# EAGLE design czujnik smrodu mkrwan v02 (EAGLE 8.6.0)
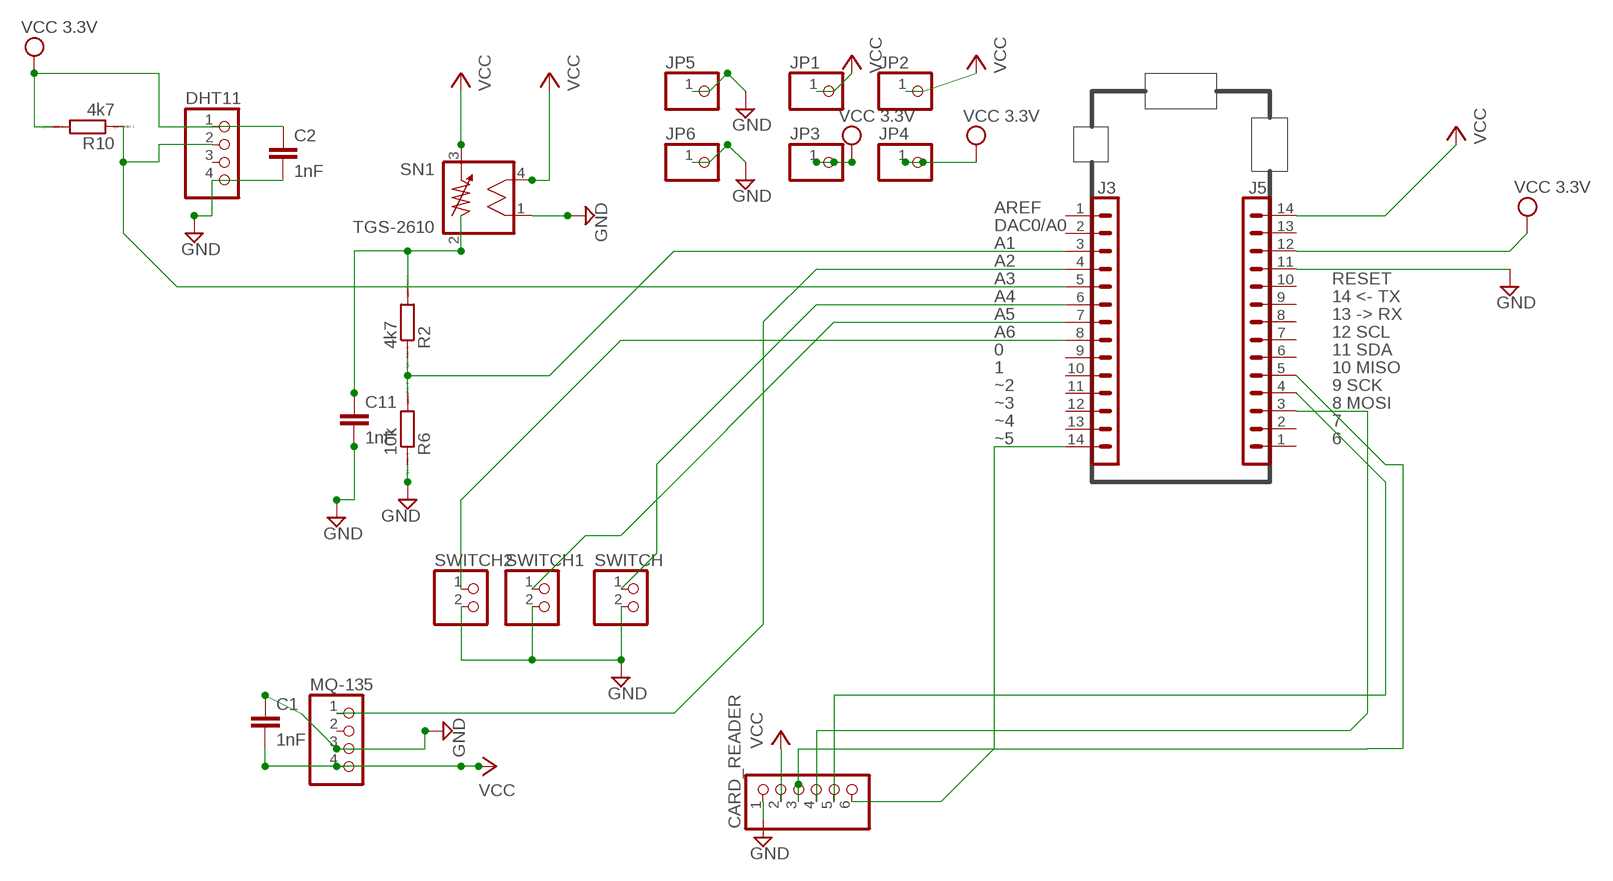
[diagram p0: schematic, sheet 1]

## Parts
C1  1nF  C2,5-3  [C2.5-3]
C2  1nF  C2,5-3  [C2.5-3]
C11  1nF  C2,5-3  [C2.5-3]
CARD_READER  PINHD-1X6  [1X06]
DHT11  PINHD-1X4  [1X04]
J3  DNP  PINHD-1X14-SMTH-SMD  [1X14_SMD_TH]
J5  DNP  PINHD-1X14-SMTH-SMD  [1X14_SMD_TH]
JP1  PINHD-1X1  [1X01]
JP2  PINHD-1X1  [1X01]
JP3  PINHD-1X1  [1X01]
JP4  PINHD-1X1  [1X01]
JP5  PINHD-1X1  [1X01]
JP6  PINHD-1X1  [1X01]
MQ-135  PINHD-1X4  [1X04]
R2  4k7  R0207/10  [0207/10]
R6  10k  R0207/10  [0207/10]
R10  4k7  R0207/10  [0207/10]
SN1  TGS-2610  [TGS-2610]
SWITCH  PINHD-1X2  [1X02]
SWITCH1  PINHD-1X2  [1X02]
SWITCH2  PINHD-1X2  [1X02]

## Nets
GND: C1.1 C2.2 C11.2 CARD_READER.1 DHT11.4 J5.11 JP5.1 JP6.1 MQ-135.3 R6.1 SN1.1 SWITCH1.2 SWITCH2.2 SWITCH.2
N$7: CARD_READER.3 J5.5
N$9: CARD_READER.4 J5.3
N$11: CARD_READER.5 J5.4
PA04_AIN4: DHT11.2 J3.5 R10.1
PA05_AIN5: J3.6 SWITCH.1
PA06_AIN6: J3.7 SWITCH1.1
PA07_AIN7: J3.8 SWITCH2.1
PB02_AIN10: J3.3 R2.1 R6.2
PB03_AIN11: J3.4 MQ-135.1
PB11_TCC0-W5: CARD_READER.6 J3.14
TGS2603_AIN: C11.1 R2.2 SN1.2
VCC: C1.2 C2.1 CARD_READER.2 DHT11.1 J5.12 J5.14 JP1.1 JP2.1 JP3.1 JP4.1 MQ-135.4 R10.2 SN1.3 SN1.4 ; supply symbol labelled VCC 3.3V
Unconnected: DHT11.3 J3.1 J3.2 J3.9 J3.10 J3.11 J3.12 J3.13 J5.1 J5.2 J5.6 J5.7 J5.8 J5.9 J5.10 J5.13 MQ-135.2

## Notes on the sheet
- AREF
- DAC0/A0
- A1
- A2
- A3 | RESET
- A4 | 14 <- TX
- A5 | 13 -> RX
- A6 | 12 SCL
- 0 | 11 SDA
- 1 | 10 MISO
- ~2 | 9 SCK
- ~3 | 8 MOSI
- ~4 | 7
- ~5 | 6

## Library data of the parts
C1 C2 C11 = capacitor-wima:C: CAPACITOR naming: grid - package width
CARD_READER = pinhead:PINHD-1X6: PIN HEADER
DHT11 MQ-135 = pinhead:PINHD-1X4: PIN HEADER
J3 J5 = Arduino-connectors:PINHD-1X14-SM: PIN HEADER; DATASHEET: -; DISTRIBUTOR-LINK: -; DISTRIBUTOR-PN: -; MANUFACTURER: ELDECO; MANUFACTURER-PN: FH254114DF08500T
JP1-JP6 = pinhead:PINHD-1X1: PIN HEADER
R2 R6 R10 = eagle-ltspice:R: RESISTOR, European symbol; SPICEMODEL: NONE; SPICEPREFIX: R
SN1 = figaro:TGS-2610: SENSOR TGS 2610 - Gas Sensor
SWITCH SWITCH1 SWITCH2 = pinhead:PINHD-1X2: PIN HEADER

## Net classes
0 default: width 0.25 mm, drill 0.195 mm

## Board
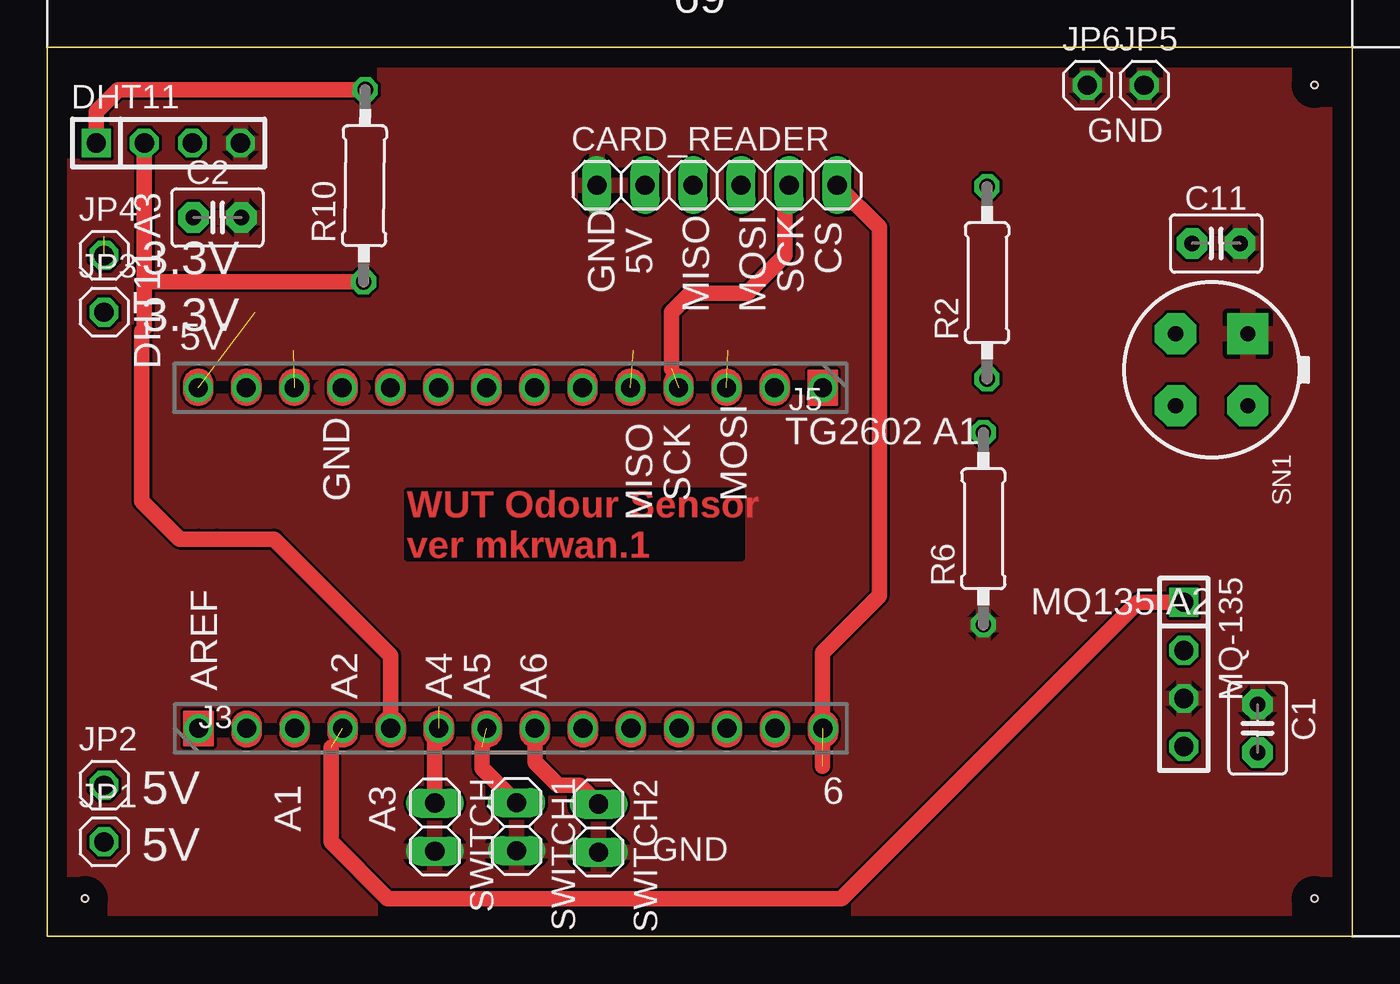
[diagram p1: board, top side]
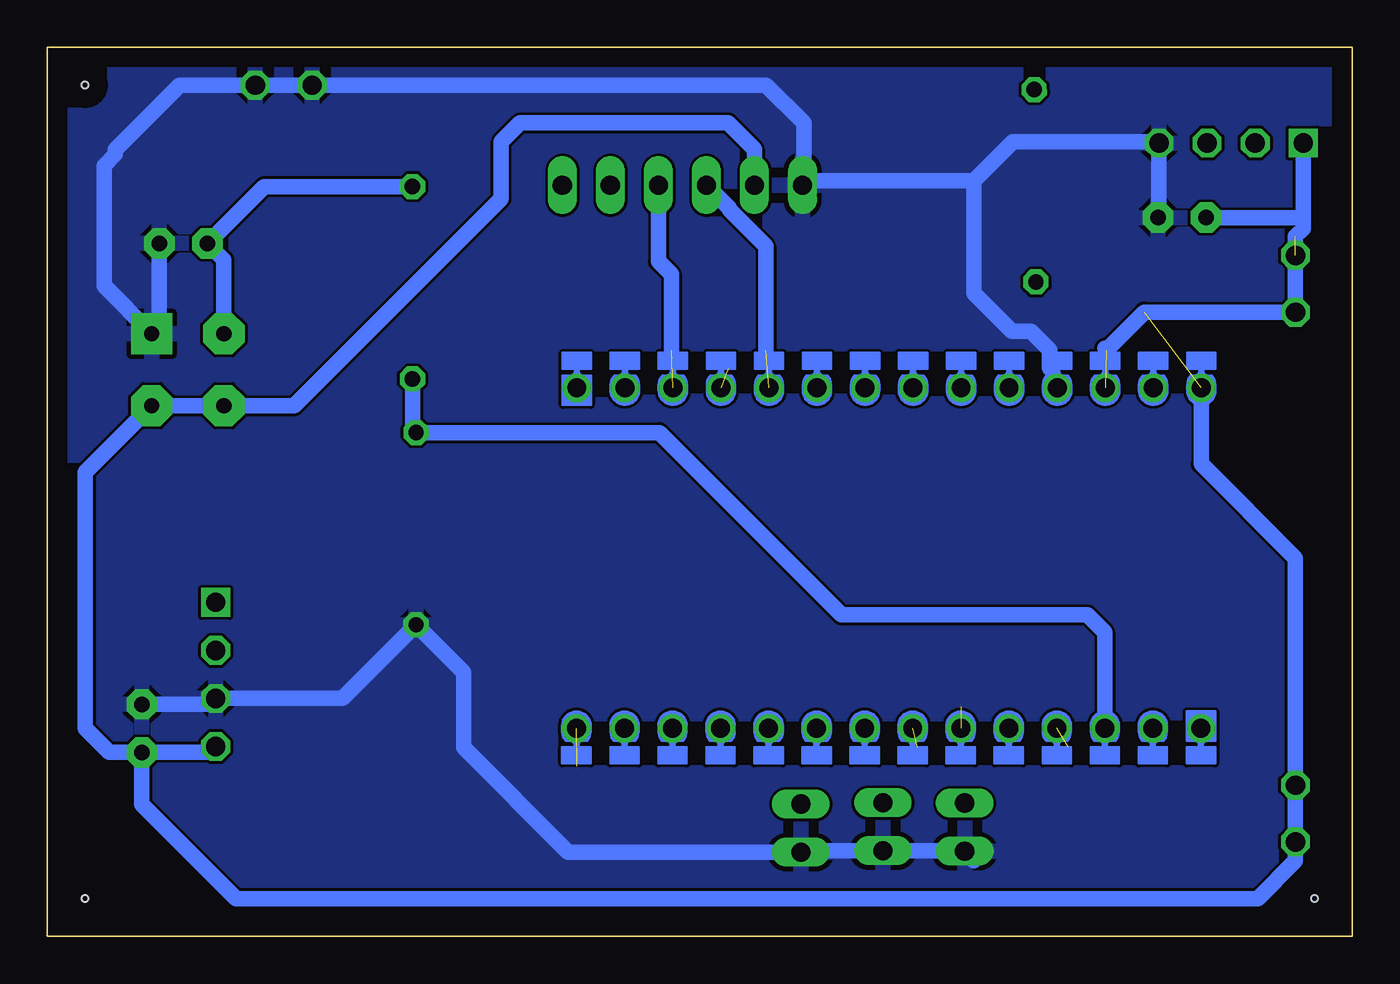
[diagram p2: board, bottom side, seen from below]

Size 69 x 47 mm. Coordinates in mm from the lower left corner, seen from the top.
Outline: 0,0 0,47 69,47 69,0 0,0
Copper layers (1*16): Top 0.035mm / dielectric 1.5mm / Bottom 0.035mm
Design rules "default": minimum track width 6mil, minimum drill 0.35mm, track to track 6mil, track to pad 6mil, pad to pad 6mil, via to via 6mil, smd to smd 6mil, copper to edge 40mil, drill to drill 6mil, minimum pad ring 10mil, minimum via ring 8mil, stop-mask expansion 4mil, vias tented up to drill 0mil, thermal gap 10mil
Holes 0.35 mm at 67,45 67,2 2,2

### Footprints (pad centres in the part's own frame; a part is rotated, then mirrored left to right if it is on the bottom)
C2.5-3 = drill 0.813 pad 1.6 octagon: 1 -1.27,0; 2 1.27,0
1X06 = drill 1.016 long: 1 -6.35,0; 2 -3.81,0; 3 -1.27,0; 4 1.27,0; 5 3.81,0; 6 6.35,0
1X04 = drill 1.016 square: 1 -3.81,0 | drill 1.016 octagon: 2 -1.27,0; 3 1.27,0; 4 3.81,0
1X14_SMD_TH = drill 1: 1 0,0; 2 2.54,0; 3 5.08,0; 4 7.62,0; 5 10.16,0; 6 12.7,0; 7 15.24,0; 8 17.78,0; 9 20.32,0; 10 22.86,0; 11 25.4,0; 12 27.94,0; 13 30.48,0; 14 33.02,0
1X01 = drill 1.016 octagon: 1 0,0
0207/10 = drill 0.813 octagon: 1 -5.08,0; 2 5.08,0
TGS-2610 = drill 0.813 pad 2.184 square: 1 -1.905,1.905 | drill 0.813 pad 2.184 octagon: 2 -1.905,-1.905; 3 1.905,-1.905; 4 1.905,1.905
1X02 = drill 1.016 long: 1 -1.27,0; 2 1.27,0

### Placement (x,y rotation side)
C1  64,11 270 top
C2  9,38 0 top
C11  61.8,36.63 0 top
CARD_READER  35.42,39.71 0 top
DHT11  6.4,41.94 0 top
J3  8,11 0 top
J5  41,29 180 top
JP1  3,5 0 top
JP2  3,8 0 top
JP3  3,33 0 top
JP4  3,36 0 top
JP5  58,45 0 top
JP6  55,45 0 top
MQ-135  60.1,13.85 270 top
R2  49.69,34.56 90 top
R6  49.5,21.56 90 top
R10  16.77,39.68 89.5 top
SN1  61.57,29.96 270 top
SWITCH  20.49,5.78 270 top
SWITCH1  24.81,5.81 270 top
SWITCH2  29.15,5.73 270 top

### Tracks (layer width: path | path; a pad name or v marks a point on that pad's centre or on a via)
GND
  Bottom 0.813: 20,4 20.53,4.54 SWITCH1.2 29.08,4.54 SWITCH2.2 41.46,4.46 47,10 47,13.98 R6.1 53.39,12.58 MQ-135.3 60.41,12.27 C1.1 | 20,39.94 28.84,39.94 CARD_READER.1 29,39.78 29,43 31,45 JP6.1 JP5.1 62,45 65.4,41.6 65.4,41.34 66,40.74 66,34.38 SN1.1 63.07,32.27 C11.2 | 20,39.94 20,34 18,32 17,32 16,31 16,30 | 20,39.94 17.94,42 10.15,42 | 10,42 10.15,42 | 10.15,42 DHT11.4 10.21,38.06 C2.2
  pour Top: 1,46 1,1 68,1 68,46
  pour Bottom: 1,46 1,1 67,1 68,2 68,46
N$7  (1 unrouted)
  Bottom 0.813: CARD_READER.3 32.93,38.49 32.93,38.4 31,36.48 31,31
N$9  (1 unrouted)
  Bottom 0.813: 36,31 36,35 36.69,35.69 CARD_READER.4
N$11  (1 unrouted)
  Top 0.813: CARD_READER.5 39,39.49 39,36 37,34 34,34 33,33 33,30
PA04_AIN4
  Top 0.813: DHT11.2 5.13,35 | 5.13,35 5.13,32.13 5,32 5,23 7,21 8,21 9,21 12,21 18.16,14.84 J3.5 | 5.13,35 5.53,34.6 R10.1
PA05_AIN5  (1 unrouted)
  Top 0.813: SWITCH.1 20.49,10.79 J3.6
PA06_AIN6  (1 unrouted)
  Top 0.813: SWITCH1.1 23,8.89 23,10
  Bottom 0.813: 23.27,11 J3.7
PA07_AIN7
  Top 0.813: SWITCH2.1 28.15,8 27,8 25.78,9.22 J3.8
PB02_AIN10
  Bottom 0.813: R2.1 49.69,26.83 R6.2 36.64,26.64 27,17 14,17 13.08,16.08 J3.3
PB03_AIN11  (1 unrouted)
  Top 0.813: MQ-135.1 57.66,17.66 42,2 18,2 15,5 15,10
PB11_TCC0-W5  (1 unrouted)
  Top 0.813: CARD_READER.6 44,37.48 44,18 41,15 41,9
TGS2603_AIN
  Bottom 0.813: R2.2 57.53,39.64 C11.1 59.67,35.77 SN1.2
VCC  (3 unrouted)
  Top 0.813: R10.2 3.76,44.76 2.59,43.59 DHT11.1
  Bottom 0.813: CARD_READER.2 31.61,41.61 33,43 44,43 45,42 45,39 55.95,28.05 SN1.3 SN1.4 67,24.53 67,11 65.73,9.73 C1.2 | J5.14 7.98,24.98 3,20 JP2.1 JP1.1 3,4 5,2 59,2 64,7 C1.2 | 13.08,31.08 13,31 11,33 JP3.1 3,37 2.59,37.41 2.59,38 | 2.59,38 DHT11.1 | 64,8 C1.2 | C2.1 2.59,38 | MQ-135.4 60.41,9.73 C1.2

### Text on the board
Top: WUT Odour Sensor / ver mkrwan.1
tNames: GND | 3.3V | 5V | CS | GND | SCK | MISO | MOSI | 3.3V | 5V | DHT11 A3 | TG2602 A1 | GND | SCK | MOSI | MISO | MQ135 A2 | A2 | A4 | A5 | A6 | AREF | A1 | A3 | 5V | 6 | 5V | GND